# EAGLE design XLR8_RX (EAGLE 7.2.0)
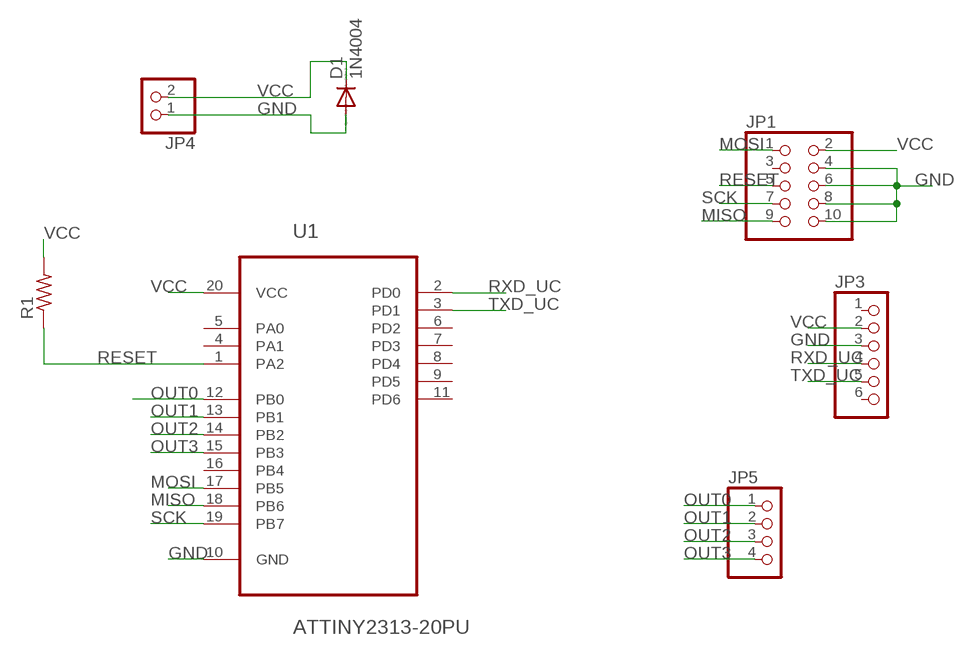
[diagram p0: schematic, sheet 1]

## Parts
D1  1N4004  [DO41-10]
JP1  PINHD-2X5  [2X05]
JP3  PINHD-1X6  [1X06]
JP4  PINHD-1X2  [1X02]
JP5  PINHD-1X4  [1X04]
R1  R-US_0207/10  [0207/10]
U1  ATTINY2313-20PU  [DIP254P762X533-20]

## Nets
GND: D1.A JP1.4 JP1.6 JP1.8 JP1.10 JP3.3 JP4.1 U1.10(GND)
MISO: JP1.9 U1.18(PB6)
MOSI: JP1.1 U1.17(PB5)
OUT0: JP5.1 U1.12(PB0)
OUT1: JP5.2 U1.13(PB1)
OUT2: JP5.3 U1.14(PB2)
OUT3: JP5.4 U1.15(PB3)
RESET: JP1.5 R1.1 U1.1(PA2)
RXD_UC: JP3.4 U1.2(PD0)
SCK: JP1.7 U1.19(PB7)
TXD_UC: JP3.5 U1.3(PD1)
VCC: D1.C JP1.2 JP3.2 JP4.2 R1.2 U1.20(VCC)
Unconnected: JP1.3 JP3.1 JP3.6 U1.4(PA1) U1.5(PA0) U1.6(PD2) U1.7(PD3) U1.8(PD4) U1.9(PD5) U1.11(PD6) U1.16(PB4)

## Library data of the parts
D1 = diode:1N4004: DIODE general purpose rectifier, 1 A
JP1 = pinhead:PINHD-2X5: PIN HEADER
JP3 = pinhead:PINHD-1X6: PIN HEADER
JP4 = pinhead:PINHD-1X2: PIN HEADER
JP5 = pinhead:PINHD-1X4: PIN HEADER
R1 = rcl:R-US_: RESISTOR, American symbol
U1 = Atmel_By_element14_Batch_1-00:ATTINY2313-20PU: Microcontroller; MPN: ATTINY2313-20PU; OC_FARNELL: 9171592; OC_NEWARK: 96K6525; PACKAGE: DIP-20; SUPPLIER: ATMEL

## Board
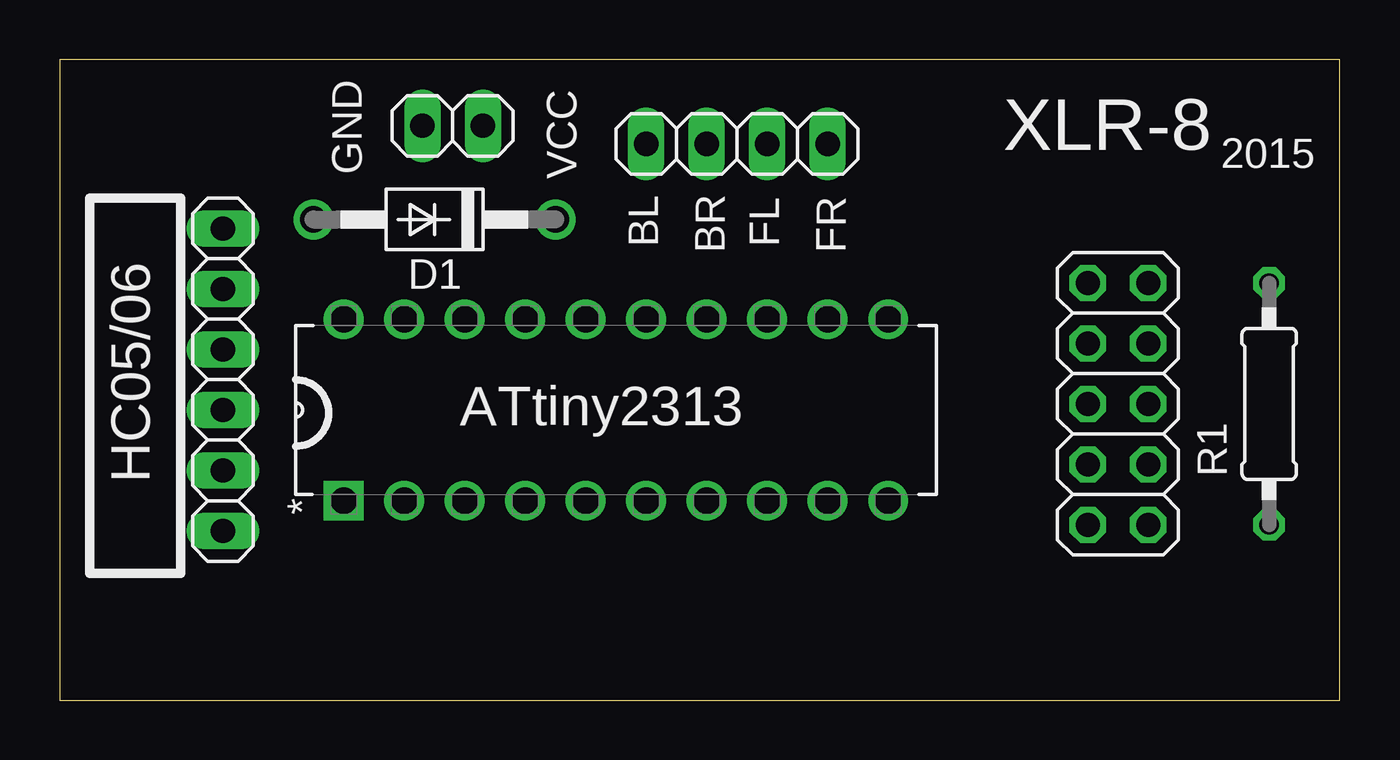
[diagram p1: board, top side]
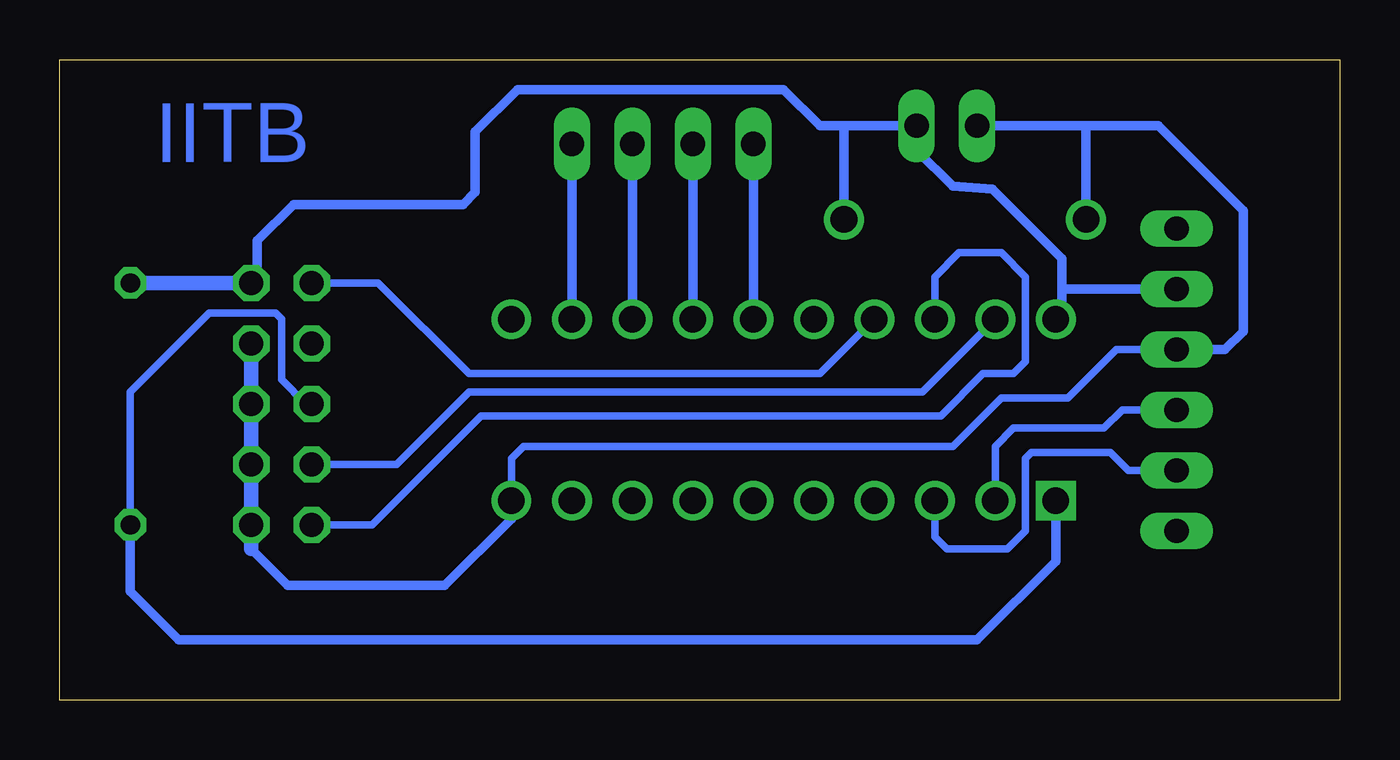
[diagram p2: board, bottom side, seen from below]

Size 53.77 x 26.91 mm. Coordinates in mm from the lower left corner, seen from the top.
Outline: 0,0 53.77,0 53.77,26.91 0,26.91 0,0
Copper layers (1*16): Top 0.035mm / dielectric 1.5mm / Bottom 0.035mm
Design rules "default": minimum track width 10mil, minimum drill 24mil, track to track 8mil, track to pad 8mil, pad to pad 8mil, via to via 8mil, smd to smd 8mil, copper to edge 40mil, drill to drill 8mil, minimum pad ring 10mil, minimum via ring 8mil, stop-mask expansion 4mil, vias tented up to drill 0mil, thermal gap 10mil

### Footprints (pad centres in the part's own frame; a part is rotated, then mirrored left to right if it is on the bottom)
DO41-10 = drill 1.118: A 5.08,0; C -5.08,0
2X05 = drill 1.016 octagon: 1 -5.08,-1.27; 2 -5.08,1.27; 3 -2.54,-1.27; 4 -2.54,1.27; 5 0,-1.27; 6 0,1.27; 7 2.54,-1.27; 8 2.54,1.27; 9 5.08,-1.27; 10 5.08,1.27
1X06 = drill 1.016 long: 1 -6.35,0; 2 -3.81,0; 3 -1.27,0; 4 1.27,0; 5 3.81,0; 6 6.35,0
1X02 = drill 1.016 long: 1 -1.27,0; 2 1.27,0
1X04 = drill 1.016 long: 1 -3.81,0; 2 -1.27,0; 3 1.27,0; 4 3.81,0
0207/10 = drill 0.813 octagon: 1 -5.08,0; 2 5.08,0
DIP254P762X533-20 = drill 1.118 square: 1 -7.62,22.86 | drill 1.118: 2 -7.62,20.32; 3 -7.62,17.78; 4 -7.62,15.24; 5 -7.62,12.7; 6 -7.62,10.16; 7 -7.62,7.62; 8 -7.62,5.08; 9 -7.62,2.54; 10 -7.62,0; 11 0,0; 12 0,2.54; 13 0,5.08; 14 0,7.62; 15 0,10.16; 16 0,12.7; 17 0,15.24; 18 0,17.78; 19 0,20.32; 20 0,22.86

### Placement (x,y rotation side)
D1  15.75,20.19 180 top
JP1  44.45,12.45 270 top
JP3  6.86,13.46 270 top
JP4  16.51,24.13 0 top
JP5  28.45,23.37 180 top
R1  50.8,12.45 90 top
U1  34.8,16 90 top

### Tracks (layer width: path | path; a pad name or v marks a point on that pad's centre or on a via)
GND
  Bottom 0.305: JP3.3 9.4,14.73 11.43,12.7 14.22,12.7 16.26,10.67 34.29,10.67 34.8,10.16 U1.10
  Bottom 0.406: U1.10 34.8,7.62 37.59,4.83 44.2,4.83 45.72,6.35 | JP4.1 10.54,24.13 | 10.54,24.13 7.62,24.13 4.06,20.57 4.06,15.49 4.83,14.73 JP3.3 | D1.A 10.67,24 10.54,24.13
  Bottom 0.61: JP1.10 JP1.8 | JP1.8 JP1.6 JP1.4 | JP1.8 45.72,6.35
MISO
  Bottom 0.305: JP1.9 40.64,7.37 36.07,11.94 16.76,11.94 14.99,13.72 13.72,13.72 13.21,14.22 13.21,17.78 14.22,18.8 16,18.8 17.02,17.78 U1.18
MOSI
  Bottom 0.305: JP1.1 40.39,17.53 36.58,13.72 21.84,13.72 U1.17
OUT0
  Bottom 0.406: U1.12 JP5.1
OUT1
  Bottom 0.406: JP5.2 U1.13
OUT2
  Bottom 0.406: U1.14 JP5.3
OUT3
  Bottom 0.406: JP5.4 U1.15
RESET
  Bottom 0.305: JP1.5 43.43,12.45 44.45,13.46 44.45,16 44.7,16.26 47.5,16.26 50.8,12.95 R1.1
  Bottom 0.406: U1.1 11.94,5.84 15.24,2.54 48.77,2.54 50.8,4.57 R1.1
RXD_UC
  Bottom 0.305: JP3.4 9.14,12.19 9.91,11.43 13.72,11.43 14.48,10.67 U1.2
SCK
  Bottom 0.305: JP1.7 39.62,9.91 36.58,12.95 17.53,12.95 U1.19
TXD_UC
  Bottom 0.305: JP3.5 8.89,9.65 9.65,10.41 12.95,10.41 13.21,10.16 13.21,7.11 13.97,6.35 16.51,6.35 17.02,6.86 U1.3
VCC
  Bottom 0.406: 20.95,24.13 JP4.2 17.78,23.11 16.26,21.59 14.61,21.46 11.68,18.54 11.68,17.27 | 20.95,24.13 21.84,24.13 23.37,25.65 34.54,25.65 36.32,23.88 36.32,21.34 36.83,20.83 43.94,20.83 45.47,19.3 45.47,17.78 JP1.2 | 11.68,17.27 11.68,16.26 U1.20 | JP3.2 11.68,17.27 | D1.C 20.83,24 20.95,24.13
  Bottom 0.61: R1.2 JP1.2

### Text on the board
Bottom: IITB
tPlace: VCC | XLR-8 | GND | 2015 | BL | BR | FL | FR | ATtiny2313 | HC05/06